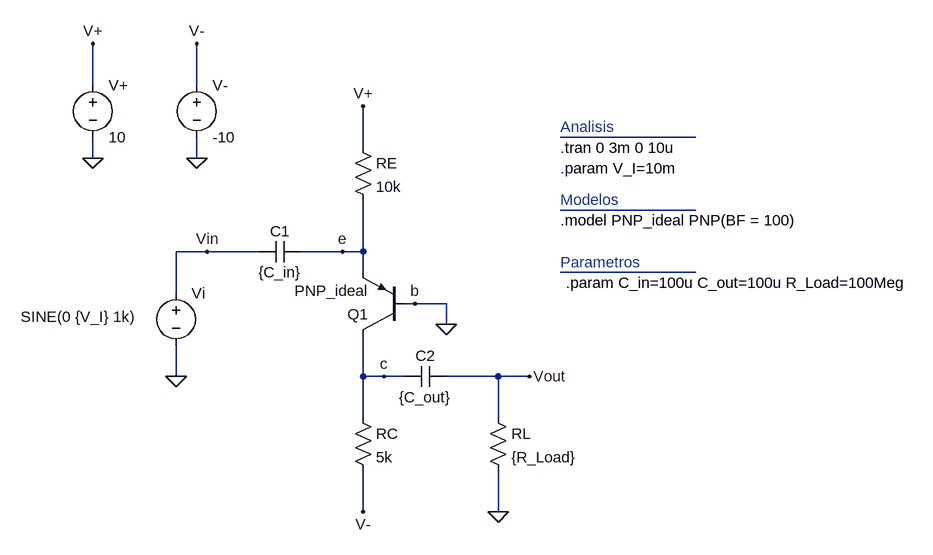
[diagram p0: schematic bjt_amp-ejemplo2_TRAN1.asc]
bjt_amp-ejemplo2_TRAN1.asc, the LTspice schematic file:
Version 4
SHEET 1 912 680
WIRE -432 -208 -432 -272
WIRE -272 -208 -272 -272
WIRE 496 -128 288 -128
WIRE -16 -112 -16 -176
WIRE -432 -96 -432 -128
WIRE -272 -96 -272 -128
WIRE 496 -16 288 -16
WIRE -256 48 -304 48
WIRE -176 48 -256 48
WIRE -48 48 -112 48
WIRE -16 48 -16 -32
WIRE -16 48 -48 48
WIRE -16 80 -16 48
WIRE 496 80 288 80
WIRE -304 112 -304 48
WIRE 64 128 48 128
WIRE 112 128 64 128
WIRE 112 160 112 128
WIRE -304 240 -304 192
WIRE -16 240 -16 176
WIRE 16 240 -16 240
WIRE 48 240 16 240
WIRE 192 240 112 240
WIRE 240 240 192 240
WIRE -16 304 -16 240
WIRE 192 304 192 240
WIRE -16 448 -16 384
WIRE 192 448 192 384
FLAG 112 160 0
FLAG -432 -96 0
FLAG -432 -272 V+
FLAG -304 240 0
FLAG -16 -176 V+
FLAG 240 240 Vout
FLAG -256 48 Vin
FLAG -272 -96 0
FLAG -272 -272 V-
FLAG -16 448 V-
FLAG 192 448 0
FLAG 64 128 b
FLAG -48 48 e
FLAG 16 240 c
SYMBOL res -32 -128 R0
SYMATTR InstName RE
SYMATTR Value 10k
SYMBOL voltage -432 -224 R0
WINDOW 123 0 0 Left 0
WINDOW 39 0 0 Left 0
SYMATTR InstName V+
SYMATTR Value 10
SYMBOL voltage -304 96 R0
WINDOW 3 -239 52 Left 2
WINDOW 123 0 0 Left 0
WINDOW 39 24 44 Left 2
SYMATTR Value SINE(0 {V_I} 1k)
SYMATTR InstName Vi
SYMBOL pnp 48 176 R180
SYMATTR InstName Q1
SYMATTR Value PNP_ideal
SYMBOL res -32 288 R0
SYMATTR InstName RC
SYMATTR Value 5k
SYMBOL voltage -272 -224 R0
WINDOW 123 0 0 Left 0
WINDOW 39 0 0 Left 0
SYMATTR InstName V-
SYMATTR Value -10
SYMBOL cap -112 32 R90
WINDOW 0 0 32 VBottom 2
WINDOW 3 32 32 VTop 2
SYMATTR InstName C1
SYMATTR Value {C_in}
SYMBOL cap 112 224 R90
WINDOW 0 0 32 VBottom 2
WINDOW 3 32 32 VTop 2
SYMATTR InstName C2
SYMATTR Value {C_out}
SYMBOL res 176 288 R0
SYMATTR InstName RL
SYMATTR Value {R_Load}
TEXT 288 -112 Left 2 !.tran 0 3m 0 10u
TEXT 288 -144 Left 2 ;Analisis
TEXT 288 0 Left 2 !.model PNP_ideal PNP(BF = 100)
TEXT 288 -32 Left 2 ;Modelos
TEXT 288 64 Left 2 ;Parametros
TEXT 296 96 Left 2 !.param C_in=100u C_out=100u R_Load=100Meg
TEXT 288 -80 Left 2 !.param V_I=10m

The netlist it stands for:
* bjt_amp-ejemplo2_TRAN1.asc
RE V+ e 10k
V+ V+ 0 10
Vi Vin 0 SINE(0 {V_I} 1k)
Q1 c 0 e 0 PNP_ideal
RC c V- 5k
V- V- 0 -10
C1 e Vin {C_in}
C2 Vout c {C_out}
RL Vout 0 {R_Load}
.model NPN NPN
.model PNP PNP
.lib standard.bjt
.tran 0 3m 0 10u
* Analisis
.model PNP_ideal PNP(BF = 100)
* Modelos
* Parametros
.param C_in=100u C_out=100u R_Load=100Meg
.param V_I=10m
.backanno
.end